# Altium schematic sheet Sheet1.SchDoc
size A
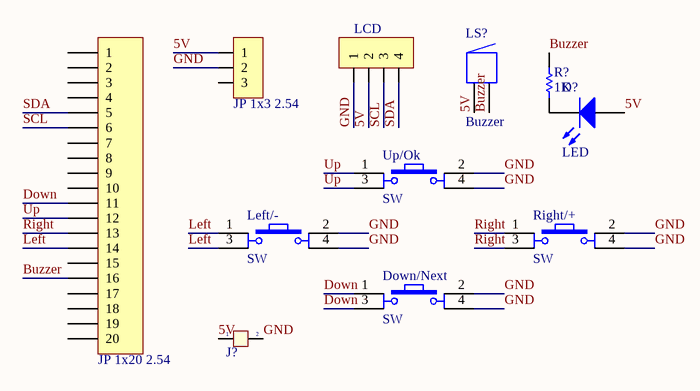
[diagram p0: Sheet1.SchDoc]

## Parts
(Parts that share a designator on the sheet are numbered #1, #2 ... from top to bottom, then left to right.)
D?  LED  [LED-0 5mm BLUE]
Down/Next  SW  [SW4]
J?  Jumper 2  [jp2h]  (value not drawn)
JP?#1  JP 1x20 2.54  [JP 1x20 CC]
JP?#2  JP 1x3 2.54  [JP 1x3 DC]
JP?#3  LCD  [JP 1x4 CC]
Left/-  SW  [SW4]
LS?  Buzzer  [Buzzer]
R?  value 1K  [Res 10mm (1/2W)]  (hidden comment: RESISTOR)
Right/+  SW  [SW4]
Up/Ok  SW  [SW4]

## Nets
5V: D?.1(A) J?.1 JP?#2.1 JP?#3.2 LS?.1
Buzzer: JP?#1.16 LS?.2 R?.2
Down: Down/Next.1 Down/Next.3 JP?#1.11
GND: Down/Next.2 Down/Next.4 J?.2 JP?#2.2 JP?#3.1 Left/-.2 Left/-.4 Right/+.2 Right/+.4 Up/Ok.2 Up/Ok.4
Left: JP?#1.14 Left/-.1 Left/-.3
Right: JP?#1.13 Right/+.1 Right/+.3
SCL: JP?#1.6 JP?#3.3
SDA: JP?#1.5 JP?#3.4
Up: JP?#1.12 Up/Ok.1 Up/Ok.3
NetD?_2: D?.2(K) R?.1

Not connected (* = marked no-connect by the designer): JP?#1 1 2 3 4 7 8 9 10 15 17 18 19 20; JP?#2 3

## Library data of the parts
D? = LED: Typical LED; Published: 8-Jun-2000; LatestRevisionDate: 08-Jul-2005; LatestRevisionNote: Mech Layer 1 removed.; PackageReference: LED-1; Publisher: Altium Limited
Down/Next Left/- Right/+ Up/Ok = SW4: Switch button 4 pin; Value: Button chip 4 pin
J? = JP 2: Value: JP 2
JP?#1 = JP 1x20 2.54 Cai Cong: Cắm; Ten_Linh_Kien: Jump Đơn Cái 2.54MM 1x40P Cong; Don_Vi: Con; Ma_Hang: MH001265; Ghi_Chu: *; Kieu_Chan: *; Chung_Loai: Cắm
JP?#2 = JP 1x3 2.54 Duc Cong: Cắm; Ten_Linh_Kien: Jump Đơn Đực 2.54MM 1x40P Cong Đứng; Don_Vi: Con; Ma_Hang: MH000904; Ghi_Chu: *; Kieu_Chan: *; Chung_Loai: Cắm
JP?#3 = JP 1x4 2.54 Cai Cong: Cắm; Ten_Linh_Kien: Jump Đơn Cái 2.54MM 1x40P Cong; Don_Vi: Con; Ma_Hang: MH001265; Ghi_Chu: *; Kieu_Chan: *; Chung_Loai: Cắm
LS? = Buzzer: Magnetic Transducer Buzzer; Published: 24-Mar-1999; LatestRevisionDate: 17-Dec-2003; LatestRevisionNote: Schematic revised, PCB Footprint replaced.; DatasheetDocument: 17-Dec-2003; PackageReference: ABSM-1574; Publisher: Altium Limited; ComponentLink1Description: Manufacturer Link; ComponentLink1URL: http://www.megastar.com/linecard/buzzmode/index.php
R? = RESISTOR: Published: 8-Jun-2000; LatestRevisionDate: 17-Jul-2002; LatestRevisionNote: Re-released for DXP Platform.; PackageReference: AXIAL-0.3; Publisher: Altium Limited